# Altium schematic sheet Sheet_1.schdoc
size 299 x 213 mm
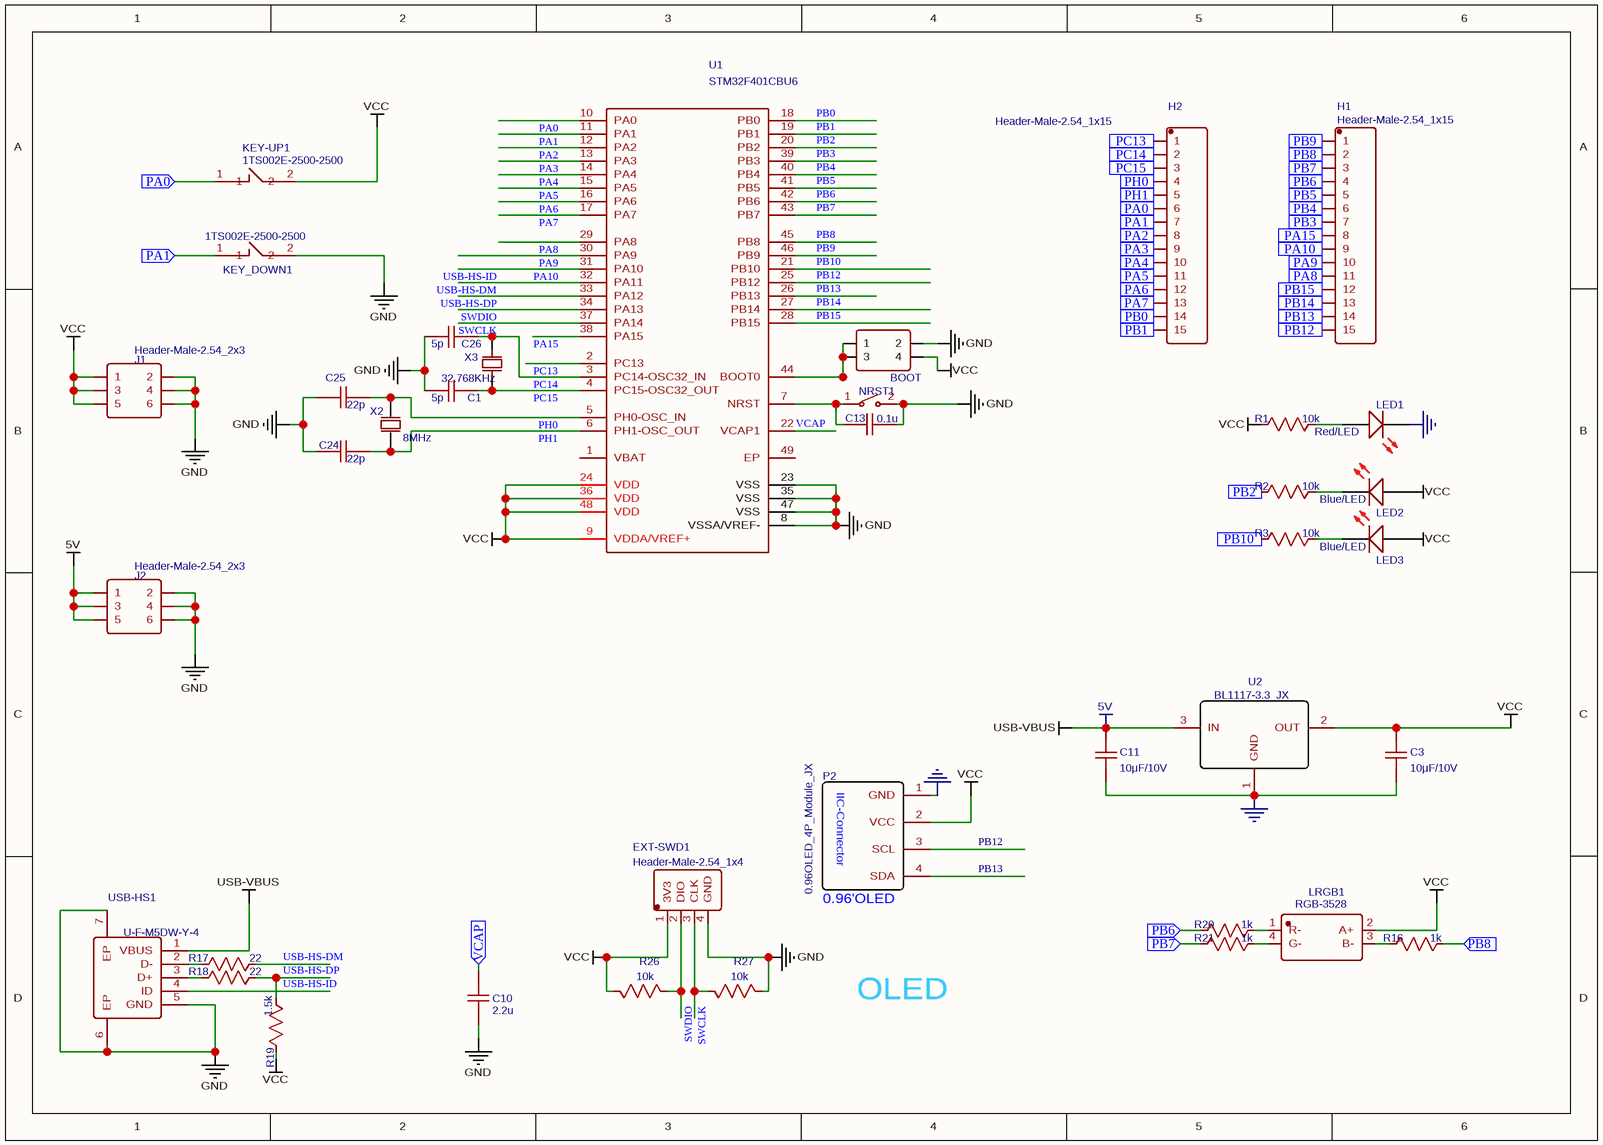
[diagram p0: Sheet_1.schdoc]

## Parts
BOOT  Header-Male-2.54_2x2  [HDR-2X2/2.54]  (value not drawn)
C1  5p  [C0603]
C3  10μF/10V  [0603_C_JX]
C10  2.2u  [C0603]
C11  10μF/10V  [0603_C_JX]
C13  0.1u  [C0603]
C24  22p  [C0603]
C25  22p  [C0603]
C26  5p  [C0603]
EXT-SWD1  Header-Male-2.54_1x4  [DIP-1X4P-2.54MM-M]
H1  Header-Male-2.54_1x15  [HDR-TH_15P-P2.54-V]
H2  Header-Male-2.54_1x15  [HDR-TH_15P-P2.54-V]
J1  Header-Male-2.54_2x3  [HDR-TH_6PIN-V-ROW2-COL3-MALE-PITCH2.54]
J2  Header-Male-2.54_2x3  [HDR-TH_6PIN-V-ROW2-COL3-MALE-PITCH2.54]
KEY-UP1  1TS002E-2500-2500  [KEY_TOUCH_SMD_6.1*3.7*H]
KEY_DOWN1  1TS002E-2500-2500  [KEY_TOUCH_SMD_6.1*3.7*H]
LED1  Red/LED  [0603_D_JX]
LED2  Blue/LED  [0603_D_JX]
LED3  Blue/LED  [0603_D_JX]
LRGB1  LED-RGB-3528  [LED 3528-4PIN]  (value not drawn)
NRST1  TS-1088R-02026  [KEY_TOUCH_SMD_6.1*3.7*H]  (value not drawn)
P2  0.96OLED_4P_Module_JX  [4P]
R1  10k  [R0603]
R2  10k  [R0603]
R3  10k  [R0603]
R16  1k  [R0603]
R17  22  [R0603]
R18  22  [R0603]
R19  1.5k  [R0603]
R20  1k  [R0603]
R21  1k  [R0603]
R26  10k  [R0603]
R27  10k  [R0603]
U1  STM32F401CBU6  [UFQFPN-48_L7.0-W7.0-P0.50-BL-EP]
U2  BL1117-3.3_JX  [SOT223_JX]
USB-HS1  U-F-M5DW-Y-4  [MICRO-USB-A12]
X2  8MHz  [贴片晶振8M]
X3  32.768KHz  [OSC-SMD_L3.2-W1.5]

## Ports
PA0 (in), PA1 (in), PA2 (in), PA3 (in), PA4 (in), PA5 (in), PA6 (in), PA7 (in), PA8 (in), PA9 (in), PA10 (in), PA15 (in), PB0 (in), PB1 (in), PB2 (in), PB3 (in), PB4 (in), PB5 (in), PB6 (in), PB7 (in), PB8 (in), PB9 (in), PB10 (in), PB12 (in), PB13 (in), PB14 (in), PB15 (in), PC13 (in), PC14 (in), PC15 (in), PH0 (in), PH1 (in), VCAP (in)

## Nets
5V: C11.2 J2.1 J2.3 J2.5 U2.3(IN) USB-HS1.1(VBUS)  [also labelled USB-VBUS]
GND: BOOT.2 C1.2 C3.1 C10.2 C11.1 C13.1 C24.2 C25.2 C26.2 EXT-SWD1.4(GND) J1.2 J1.4 J1.6 J2.2 J2.4 J2.6 KEY_DOWN1.2 LED1.2(C) NRST1.2 P2.1(GND) R27.1 U1.8(VSSA/VREF-) U1.23(VSS) U1.35(VSS) U1.47(VSS) U2.1(GND) USB-HS1.5(GND) USB-HS1.6(EP) USB-HS1.7(EP)
VCC: BOOT.4 C3.2 EXT-SWD1.1(3V3) J1.1 J1.3 J1.5 KEY-UP1.2 LED2.1(A) LED3.1(A) LRGB1.2(A+) P2.2(VCC) R1.2 R19.1 R26.2 U1.9(VDDA/VREF+) U1.24(VDD) U1.36(VDD) U1.48(VDD) U2.2(OUT)
PA0: U1.10(PA0)
PA0: H2.6 KEY-UP1.1 ; port PA0  [a separate net that carries the same name]
PA1: U1.11(PA1)
PA1: H2.7 KEY_DOWN1.1 ; port PA1  [a separate net that carries the same name]
PA2: U1.12(PA2)
PA2: H2.8 ; port PA2  [a separate net that carries the same name]
PA3: U1.13(PA3)
PA3: H2.9 ; port PA3  [a separate net that carries the same name]
PA4: U1.14(PA4)
PA4: H2.10 ; port PA4  [a separate net that carries the same name]
PA5: U1.15(PA5)
PA5: H2.11 ; port PA5  [a separate net that carries the same name]
PA6: U1.16(PA6)
PA6: H2.12 ; port PA6  [a separate net that carries the same name]
PA7: U1.17(PA7)
PA7: H2.13 ; port PA7  [a separate net that carries the same name]
PA8: U1.29(PA8)
PA8: H1.11 ; port PA8  [a separate net that carries the same name]
PA9: U1.30(PA9)
PA9: H1.10 ; port PA9  [a separate net that carries the same name]
PA10: U1.31(PA10) USB-HS1.4(ID)  [also labelled USB-HS-ID]
PA10: H1.9 ; port PA10  [a separate net that carries the same name]
PA15: U1.38(PA15)
PA15: H1.8 ; port PA15  [a separate net that carries the same name]
PB0: U1.18(PB0)
PB0: H2.14 ; port PB0  [a separate net that carries the same name]
PB1: U1.19(PB1)
PB1: H2.15 ; port PB1  [a separate net that carries the same name]
PB2: U1.20(PB2)
PB2: R2.2 ; port PB2  [a separate net that carries the same name]
PB3: U1.39(PB3)
PB3: H1.7 ; port PB3  [a separate net that carries the same name]
PB4: U1.40(PB4)
PB4: H1.6 ; port PB4  [a separate net that carries the same name]
PB5: U1.41(PB5)
PB5: H1.5 ; port PB5  [a separate net that carries the same name]
PB6: U1.42(PB6)
PB6: H1.4 R20.2 ; port PB6  [a separate net that carries the same name]
PB7: U1.43(PB7)
PB7: H1.3 R21.2 ; port PB7  [a separate net that carries the same name]
PB8: U1.45(PB8)
PB8: H1.2 R16.1 ; port PB8  [a separate net that carries the same name]
PB9: U1.46(PB9)
PB9: H1.1 ; port PB9  [a separate net that carries the same name]
PB10: U1.21(PB10)
PB10: R3.2 ; port PB10  [a separate net that carries the same name]
PB12: P2.3(SCL) U1.25(PB12)
PB12: H1.15 ; port PB12  [a separate net that carries the same name]
PB13: P2.4(SDA) U1.26(PB13)
PB13: H1.14 ; port PB13  [a separate net that carries the same name]
PB14: U1.27(PB14)
PB14: H1.13 ; port PB14  [a separate net that carries the same name]
PB15: U1.28(PB15)
PB15: H1.12 ; port PB15  [a separate net that carries the same name]
PC13: U1.2(PC13)
PC13: H2.1 ; port PC13  [a separate net that carries the same name]
PC14: C26.1 U1.3(PC14-OSC32_IN) X3.2(OSC2)
PC14: H2.2 ; port PC14  [a separate net that carries the same name]
PC15: C1.1 U1.4(PC15-OSC32_OUT) X3.1(OSC1)
PC15: H2.3 ; port PC15  [a separate net that carries the same name]
PH0: C25.1 U1.5(PH0-OSC_IN) X2.2(OSC2)
PH0: H2.4 ; port PH0  [a separate net that carries the same name]
PH1: C24.1 U1.6(PH1-OSC_OUT) X2.1(OSC1)
PH1: H2.5 ; port PH1  [a separate net that carries the same name]
SWCLK: EXT-SWD1.3(CLK) R27.2 U1.37(PA14)
SWDIO: EXT-SWD1.2(DIO) R26.1 U1.34(PA13)
USB-HS-DM: R17.2 U1.32(PA11)
USB-HS-DP: R18.2 R19.2 U1.33(PA12)
VCAP: U1.22(VCAP1)
VCAP: C10.1 ; port VCAP  [a separate net that carries the same name]
NetBOOT_1: BOOT.1 BOOT.3 U1.44(BOOT0)
NetC13_2: C13.2 NRST1.1 U1.7(NRST)
NetLED1_1: LED1.1(A) R1.1
NetLED2_2: LED2.2(C) R2.1
NetLED3_2: LED3.2(C) R3.1
NetLRGB1_1: LRGB1.1(R-) R20.1
NetLRGB1_3: LRGB1.3(B-) R16.2
NetLRGB1_4: LRGB1.4(G-) R21.1
NetR17_1: R17.1 USB-HS1.2(D-)
NetR18_1: R18.1 USB-HS1.3(D+)

Not connected (* = marked no-connect by the designer): U1 1(VBAT) 49(EP)

## Notes on the sheet
- OLED
- (in symbol 0.96OLED_4P_Module_JX) IIC-Connector; 0.96'OLED
- (in symbol LED-RGB-3528) RGB-3528

## Library data of the parts
BOOT = Header-Male-2.54_2x2: BOM_Manufacturer: BOOMELE; BOM_Manufacturer Part: Double Rows2.54mm2*2pHeaders  Pins; BOM_Supplier: LCSC; BOM_Supplier Part: C66690; spicePre: P
C1 C26 = 5p: nameAlias: Value(F); BOM_Manufacturer Part: ?; spicePre: C; spiceSymbolName: Cap_RAD-0.1_US
C3 C11 = 10μF/10V: nameAlias: Value(F); spicePre: C; spiceSymbolName: Capacitor; BOM_Supplier: LCSC
C10 = 2.2u: nameAlias: Value(F); spicePre: C; spiceSymbolName: Cap_0805_US
C13 = 0.1u: nameAlias: Value(F); spicePre: C; spiceSymbolName: Cap_0805_US
C24 C25 = 22p: nameAlias: Value(F); BOM_Manufacturer Part: ?; spicePre: C; spiceSymbolName: Cap_RAD-0.1_US
EXT-SWD1 = Header-Male-2.54_1x4: BOM_Manufacturer: Ckmtw; BOM_Manufacturer Part: 210S-1*4P L=11.6MMGold-plated black; Contributor: LCSC; BOM_Supplier: LCSC; BOM_Supplier Part: C124378; spicePre: H
H1 H2 = Header-Male-2.54_1x15: BOM_Manufacturer: Ckmtw; BOM_Manufacturer Part: 210S-1*15P L=11.6MMGold-plated black; Contributor: LCSC; BOM_Supplier: LCSC; BOM_Supplier Part: C124373; spicePre: H; spiceSymbolName: Header-Male-2.54_1x15
J1 J2 = Header-Male-2.54_2x3: BOM_Manufacturer: BOOMELE; BOM_Supplier: LCSC; BOM_Manufacturer Part: Header-Male-2.54_2x3; BOM_Supplier Part: C65114; spicePre: J; spiceSymbolName: Header-Male-2.54_2x3
KEY-UP1 KEY_DOWN1 = 1TS002E-2500-2500: BOM_Manufacturer: HYP; Contributor: LCSC; BOM_Supplier: LCSC; BOM_Supplier Part: C329185; BOM_Manufacturer Part: 1TS002E-2500-2500; spicePre: S; spiceSymbolName: 1TS002E-2500-2500
LRGB1 = LED-RGB-3528: Contributor: kongyus; BOM_Manufacturer Part: ?; spicePre: L
NRST1 = TS-1088R-02026: BOM_Manufacturer: XUNPU; Contributor: LCSC; BOM_Supplier: LCSC; BOM_Supplier Part: C455280; BOM_Manufacturer Part: TS-1088R-02026; spicePre: S; spiceSymbolName: TS-1088R-02026
R1-R3 R26 R27 = 10k: nameAlias: Value(Ω); BOM_Manufacturer Part: ?; spicePre: R; spiceSymbolName: Res_AXIAL-0.3(1/8W)_US
R16 R20 R21 = 1k: nameAlias: Value(Ω); BOM_Manufacturer Part: ?; spicePre: R; spiceSymbolName: Res_AXIAL-0.3(1/8W)_US
R17 R18 = 22: nameAlias: Value(Ω); spicePre: R; spiceSymbolName: Res_0805(1/8W)_US
R19 = 1.5k: nameAlias: Value(Ω); spicePre: R; spiceSymbolName: Res_0805(1/8W)_US
U1 = STM32F401CBU6: BOM_Manufacturer: STMicroelectronics; Voltage - Supply: 1.7V ~ 3.6V; Contributor: LCSC; SMT Type: Extend; BOM_Supplier: LCSC; BOM_Manufacturer Part: STM32F401CBU6; BOM_Supplier Part: C118825; BOM_LCSC Assembly: Yes; spicePre: U; spiceSymbolName: STM32F401CBU6
U2 = BL1117-3.3_JX: Contributor: jixin002; spicePre: U
USB-HS1 = U-F-M5DW-Y-4: BOM_Manufacturer: HRO; Contributor: LCSC; BOM_Supplier: LCSC; BOM_Manufacturer Part: U-F-M5DW-Y-4; BOM_Supplier Part: C145784; spicePre: U
X2 = 8MHz: BOM_Manufacturer: ZheJiang East Crystal Elec; BOM_Manufacturer Part: B08000J065; nameAlias: Frequency; Contributor: LCSC; BOM_Supplier: LCSC; BOM_Supplier Part: C258976; spicePre: X; spiceSymbolName: B08000J065
X3 = 32.768KHz: BOM_Manufacturer: JGHC; BOM_Manufacturer Part: SMD31327681252090; nameAlias: Value; Contributor: LCSC; BOM_Supplier: LCSC; BOM_Supplier Part: C390740; spicePre: X; spiceSymbolName: SMD31327681252090
LED1 = Red/LED: BOM_Supplier: LCSC; spicePre: L
LED2 LED3 = Blue/LED: BOM_Supplier: LCSC; spicePre: L
P2 = 0.96OLED_4P_Module_JX: spicePre: P